# Altium schematic sheet PowCarbinBoard_MCU.SchDoc
size A3
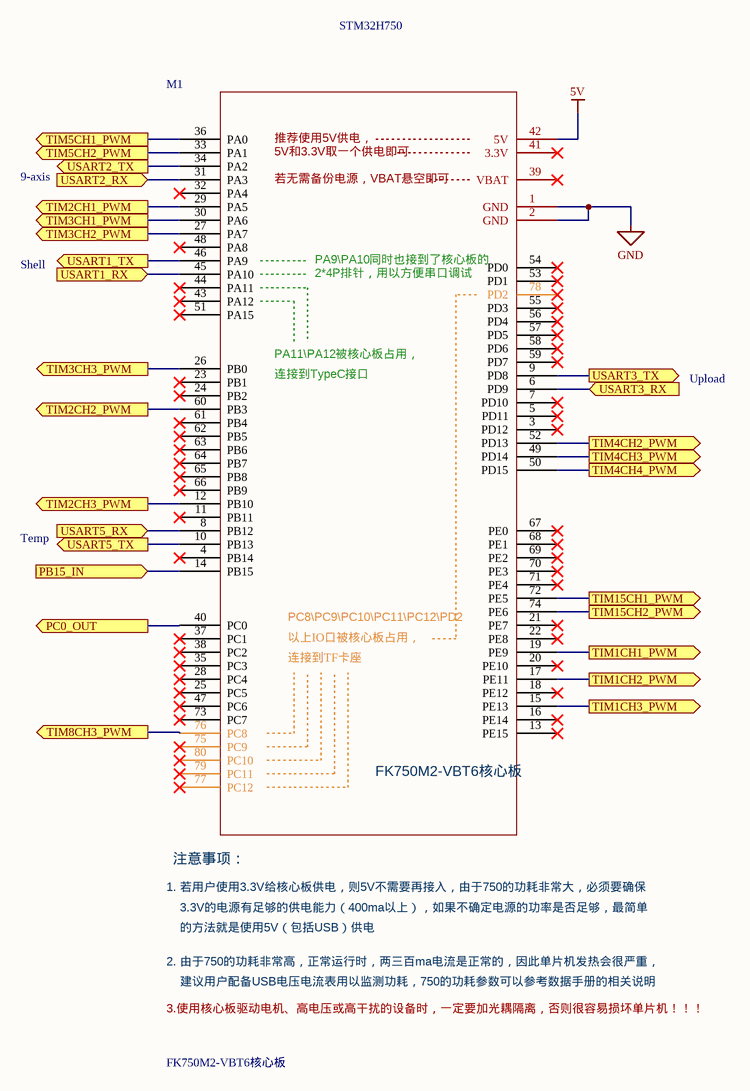
[diagram p0: PowCarbinBoard_MCU.SchDoc]

## Parts
M1  FK750M2-VBT6核心板  [FK750M2-VBT6(精简版)]

## Ports
PB15_IN (in), PC0_OUT (out), TIM1CH1_PWM (out), TIM1CH2_PWM (out), TIM1CH3_PWM (out), TIM2CH1_PWM (out), TIM2CH2_PWM (out), TIM2CH3_PWM (out), TIM3CH1_PWM (out), TIM3CH2_PWM (out), TIM3CH3_PWM (out), TIM4CH2_PWM (out), TIM4CH3_PWM (out), TIM4CH4_PWM (out), TIM5CH1_PWM (out), TIM5CH2_PWM (out), TIM8CH3_PWM (out), TIM15CH1_PWM (out), TIM15CH2_PWM (out), USART1_RX (in), USART1_TX (out), USART2_RX (in), USART2_TX (out), USART3_RX (in), USART3_TX (out), USART5_RX (in), USART5_TX (out)

## Nets
5V: M1.42(5V)
GND: M1.1(GND) M1.2(GND)
PB15_IN: M1.14(PB15) ; port PB15_IN
PC0_OUT: M1.40(PC0) ; port PC0_OUT
TIM1CH1_PWM: M1.19(PE9) ; port TIM1CH1_PWM
TIM1CH2_PWM: M1.17(PE11) ; port TIM1CH2_PWM
TIM1CH3_PWM: M1.15(PE13) ; port TIM1CH3_PWM
TIM2CH1_PWM: M1.29(PA5) ; port TIM2CH1_PWM
TIM2CH2_PWM: M1.60(PB3) ; port TIM2CH2_PWM
TIM2CH3_PWM: M1.12(PB10) ; port TIM2CH3_PWM
TIM3CH1_PWM: M1.30(PA6) ; port TIM3CH1_PWM
TIM3CH2_PWM: M1.27(PA7) ; port TIM3CH2_PWM
TIM3CH3_PWM: M1.26(PB0) ; port TIM3CH3_PWM
TIM4CH2_PWM: M1.52(PD13) ; port TIM4CH2_PWM
TIM4CH3_PWM: M1.49(PD14) ; port TIM4CH3_PWM
TIM4CH4_PWM: M1.50(PD15) ; port TIM4CH4_PWM
TIM5CH1_PWM: M1.36(PA0) ; port TIM5CH1_PWM
TIM5CH2_PWM: M1.33(PA1) ; port TIM5CH2_PWM
TIM8CH3_PWM: M1.76(PC8) ; port TIM8CH3_PWM
TIM15CH1_PWM: M1.72(PE5) ; port TIM15CH1_PWM
TIM15CH2_PWM: M1.74(PE6) ; port TIM15CH2_PWM
USART1_RX: M1.45(PA10) ; port USART1_RX
USART1_TX: M1.46(PA9) ; port USART1_TX
USART2_RX: M1.31(PA3) ; port USART2_RX
USART2_TX: M1.34(PA2) ; port USART2_TX
USART3_RX: M1.6(PD9) ; port USART3_RX
USART3_TX: M1.9(PD8) ; port USART3_TX
USART5_RX: M1.8(PB12) ; port USART5_RX
USART5_TX: M1.10(PB13) ; port USART5_TX

Not connected (* = marked no-connect by the designer): M1 3(PD12)* 4(PB14)* 5(PD11)* 7(PD10)* 11(PB11)* 13(PE15)* 16(PE14)* 18(PE12)* 20(PE10)* 21(PE7)* 22(PE8)* 23(PB1)* 24(PB2)* 25(PC5)* 28(PC4)* 32(PA4)* 35(PC3)* 37(PC1)* 38(PC2)* 39(VBAT)* 41(3.3V)* 43(PA12)* 44(PA11)* 47(PC6)* 48(PA8)* 51(PA15)* 53(PD1)* 54(PD0)* 55(PD3)* 56(PD4)* 57(PD5)* 58(PD6)* 59(PD7)* 61(PB4)* 62(PB5)* 63(PB6)* 64(PB7)* 65(PB8)* 66(PB9)* 67(PE0)* 68(PE1)* 69(PE2)* 70(PE3)* 71(PE4)* 73(PC7)* 75(PC9)* 77(PC12)* 78(PD2)* 79(PC11)* 80(PC10)*

## Notes on the sheet
- STM32H750
- 9-axis
- Shell
- Upload
- Temp
- (in symbol FK750M2-VBT6) 推荐使用5V供电，; 5V和3.3V取一个供电即可; 若无需备份电源，VBAT悬空即可; PA9\PA10同时也接到了核心板的; 2*4P排针，用以方便串口调试; PA11\PA12被核心板占用，; 连接到TypeC接口; PC8\PC9\PC10\PC11\PC12\PD2; 以上IO口被核心板占用，; 连接到TF卡座; 注意事项：; 1. 若用户使用3.3V给核心板供电，则5V不需要再接入，由于750的功耗非常大，必须要确保; 3.3V的电源有足够的供电能力（400ma以上），如果不确定电源的功率是否足够，最简单; 的方法就是使用5V（包括USB）供电; 2. 由于750的功耗非常高，正常运行时，两三百ma电流是正常的，因此单片机发热会很严重，; 建议用户配备USB电压电流表用以监测功耗，750的功耗参数可以参考数据手册的相关说明; 3.使用核心板驱动电机、高电压或高干扰的设备时，一定要加光耦隔离，否则很容易损坏单片机！！！

## Library data of the parts
M1 = FK750M2-VBT6